# EAGLE schematic Lpc1114 (EAGLE 6.4)
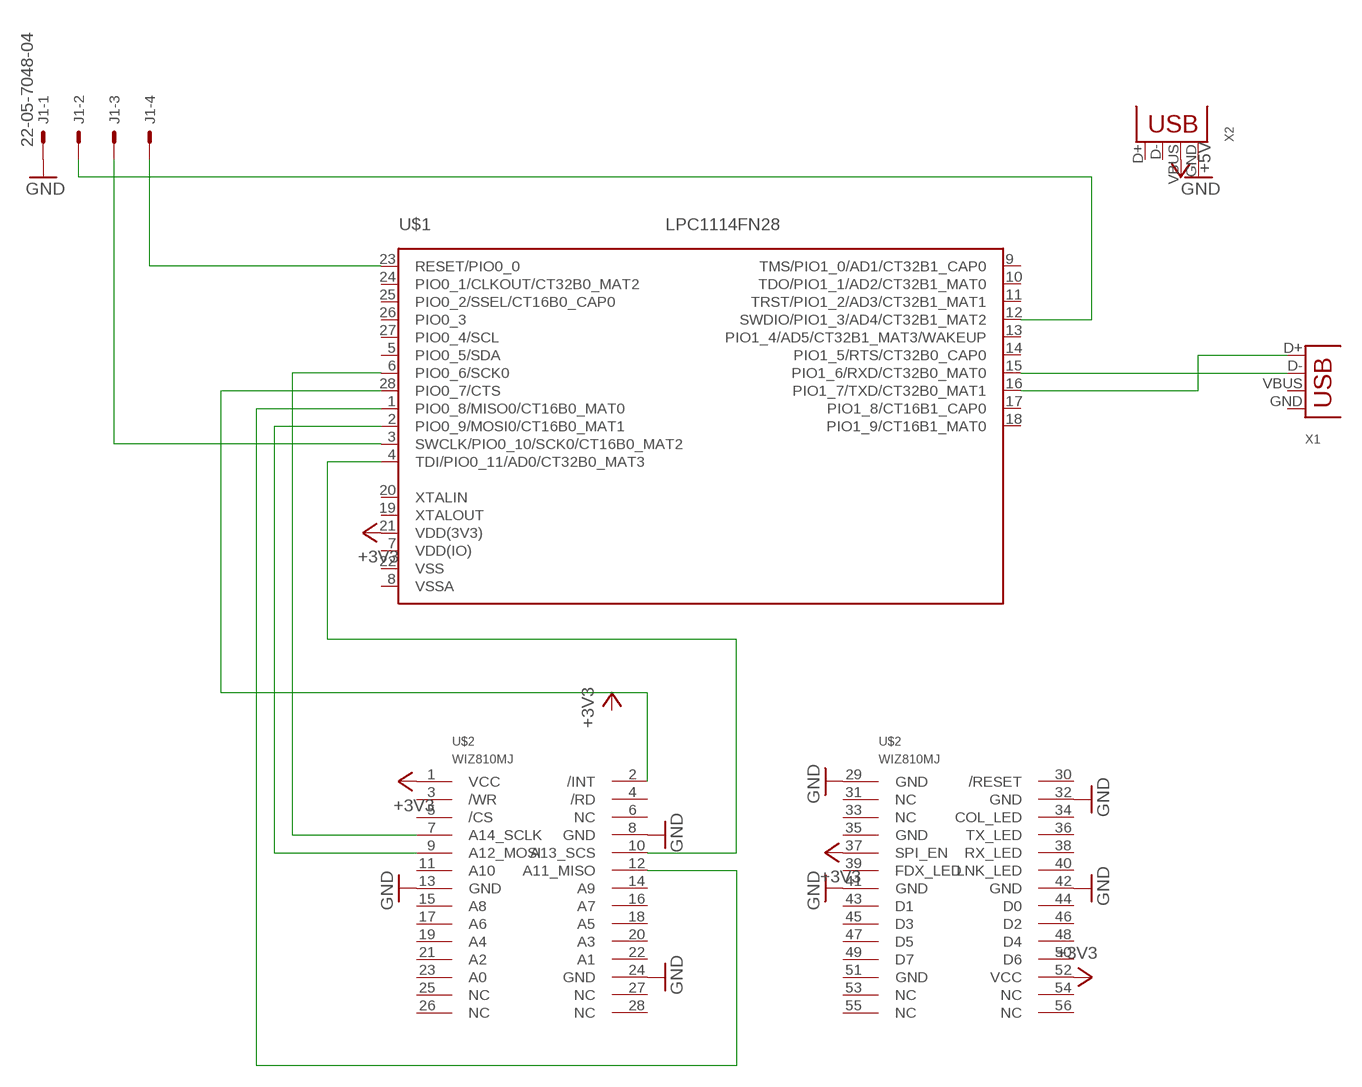
[diagram p0: schematic, sheet 1]

## Parts
J1  22-05-7048-04  [7395-04]
U$1  LPC1114FN28  [DIP28]
U$2  WIZ810MJ  [WIZ810MJ]
X1  USB-A-H  [USB-A-H]
X2  USB-B-H  [USB-B-H]

## Nets
+3V3: U$1.21(VDD(3V3)) U$2.1(VCC) U$2.37(SPI_EN) U$2.52(VCC)
+5V: X2.VBUS
GND: J1.1 U$2.8(GND) U$2.13(GND) U$2.24(GND) U$2.29(GND) U$2.32(GND) U$2.41(GND) U$2.42(GND) X2.GND
N$1: U$1.6(PIO0_6/SCK0) U$2.7(A14_SCLK)
N$2: U$1.2(PIO0_9/MOSI0/CT16B0_MAT1) U$2.9(A12_MOSI)
N$3: U$1.1(PIO0_8/MISO0/CT16B0_MAT0) U$2.12(A11_MISO)
N$4: J1.4 U$1.23(RESET/PIO0_0)
N$5: J1.3 U$1.3(SWCLK/PIO0_10/SCK0/CT16B0_MAT2)
N$6: J1.2 U$1.12(SWDIO/PIO1_3/AD4/CT32B1_MAT2)
N$7: U$1.16(PIO1_7/TXD/CT32B0_MAT1) X1.D+
N$8: U$1.15(PIO1_6/RXD/CT32B0_MAT0) X1.D-
N$9: U$1.4(TDI/PIO0_11/AD0/CT32B0_MAT3) U$2.10(A13_SCS)
N$10: U$1.28(PIO0_7/CTS) U$2.2(/INT)
Unconnected: U$1.5(PIO0_5/SDA) U$1.9(TMS/PIO1_0/AD1/CT32B1_CAP0) U$1.10(TDO/PIO1_1/AD2/CT32B1_MAT0) U$1.11(TRST/PIO1_2/AD3/CT32B1_MAT1) U$1.13(PIO1_4/AD5/CT32B1_MAT3/WAKEUP) U$1.14(PIO1_5/RTS/CT32B0_CAP0) U$1.17(PIO1_8/CT16B1_CAP0) U$1.18(PIO1_9/CT16B1_MAT0) U$1.19(XTALOUT) U$1.20(XTALIN) U$1.24(PIO0_1/CLKOUT/CT32B0_MAT2) U$1.25(PIO0_2/SSEL/CT16B0_CAP0) U$1.26(PIO0_3) U$1.27(PIO0_4/SCL) U$2.3(/WR) U$2.4(/RD) U$2.5(/CS) U$2.6(NC) U$2.11(A10) U$2.14(A9) U$2.15(A8) U$2.16(A7) U$2.17(A6) U$2.18(A5) U$2.19(A4) U$2.20(A3) U$2.21(A2) U$2.22(A1) U$2.23(A0) U$2.25(NC) U$2.26(NC) U$2.27(NC) U$2.28(NC) U$2.30(/RESET) U$2.31(NC) U$2.33(NC) U$2.34(COL_LED) U$2.35(GND) U$2.36(TX_LED) U$2.38(RX_LED) U$2.39(FDX_LED) U$2.40(LNK_LED) U$2.43(D1) U$2.44(D0) U$2.45(D3) U$2.46(D2) U$2.47(D5) U$2.48(D4) U$2.49(D7) U$2.50(D6) U$2.51(GND) U$2.53(NC) U$2.54(NC) U$2.55(NC) U$2.56(NC) X1.GND X1.VBUS X2.D+ X2.D-

## Power pins joined to a net without a drawn wire
VDD(IO): U$1.7(VDD(IO))
VSS: U$1.22(VSS)
VSSA: U$1.8(VSSA)

## Library data of the parts
J1 = con-molex:22-?-04: CONNECTOR wire to board 2.54 mm (.1 inch) pitch header; OC_FARNELL: unknown; OC_NEWARK: unknown
U$1 = lieven:LPC1114FN28: LPC1114FN28
U$2 = WIZNET:WIZ810MJ
X1 X2 = lieven:USB: USB Connectors